# Altium schematic sheet [7]-INPUTS.SchDoc
size A4
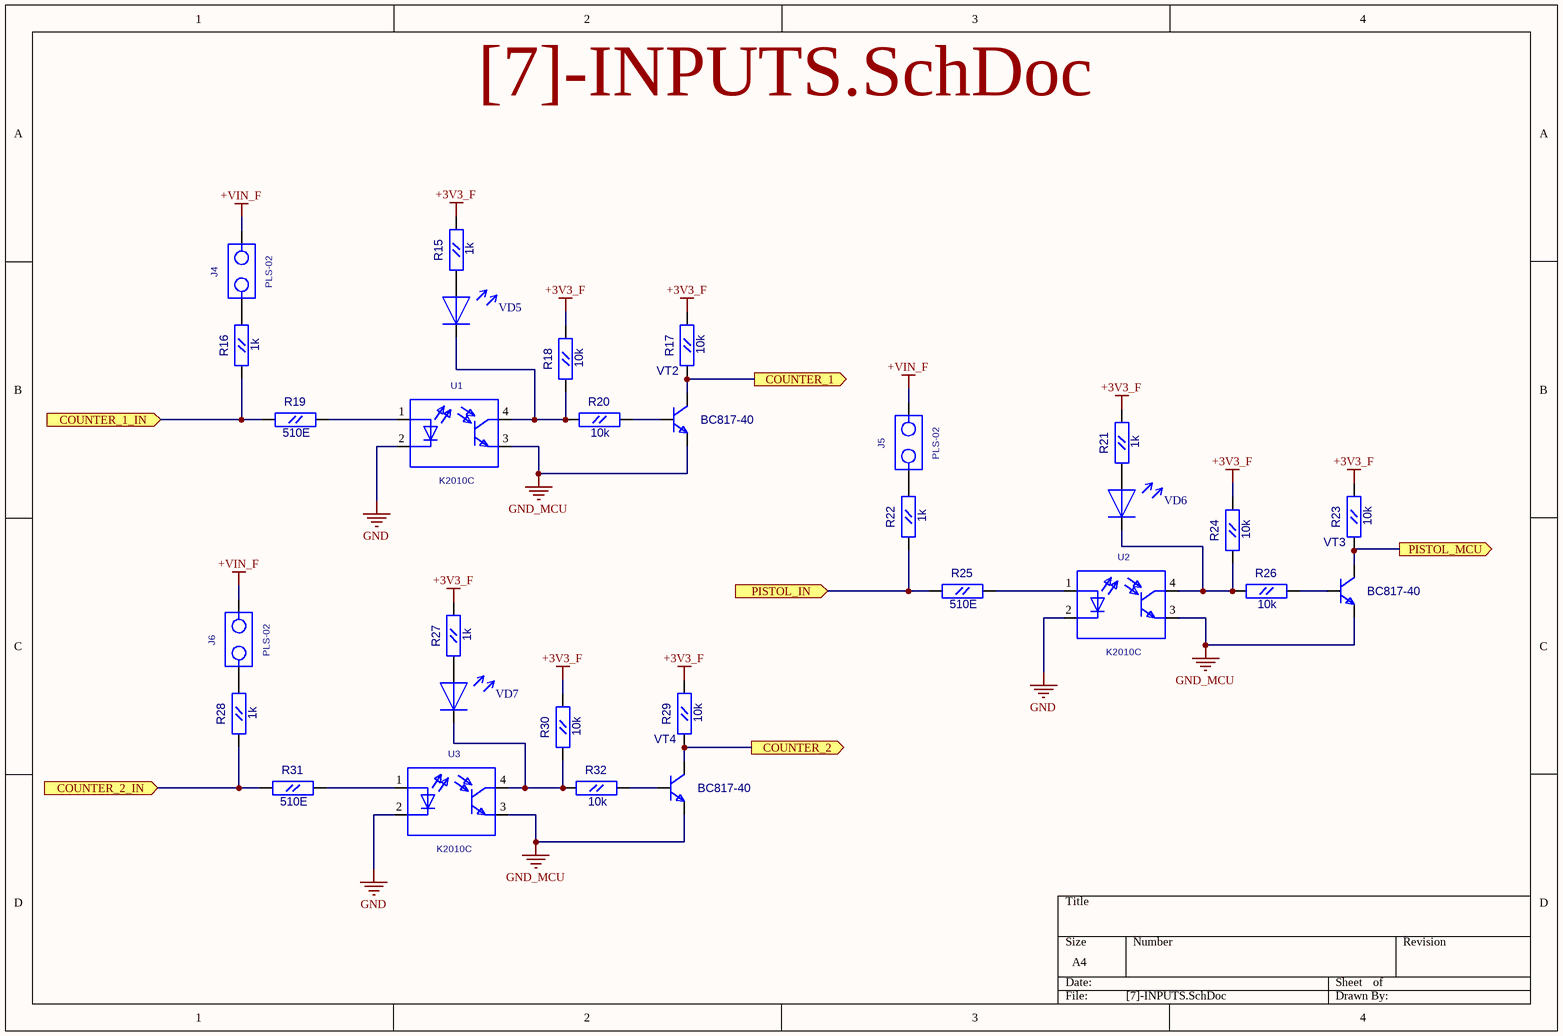
[diagram p0: [7]-INPUTS.SchDoc]

## Parts
J4  PLS-02  [PLS-02]
J5  PLS-02  [PLS-02]
J6  PLS-02  [PLS-02]
R15  1k  [RC0603]
R16  1k  [RC0603]
R17  10k  [RC0603]
R18  10k  [RC0603]
R19  510E  [RC0603]
R20  10k  [RC0603]
R21  1k  [RC0603]
R22  1k  [RC0603]
R23  10k  [RC0603]
R24  10k  [RC0603]
R25  510E  [RC0603]
R26  10k  [RC0603]
R27  1k  [RC0603]
R28  1k  [RC0603]
R29  10k  [RC0603]
R30  10k  [RC0603]
R31  510E  [RC0603]
R32  10k  [RC0603]
U1  K2010C  [PC817]
U2  K2010C  [PC817]
U3  K2010C  [PC817]
VD5  LED_0805  [LED0805]  (value not drawn)
VD6  LED_0805  [LED0805]  (value not drawn)
VD7  LED_0805  [LED0805]  (value not drawn)
VT2  BC817-40  [SOT-23(123)]
VT3  BC817-40  [SOT-23(123)]
VT4  BC817-40  [SOT-23(123)]

## Ports
COUNTER_1 (out), COUNTER_1_IN (in), COUNTER_2 (out), COUNTER_2_IN (in), PISTOL_IN (in), PISTOL_MCU (out)

## Nets
+3V3_F: R15.2(B) R17.2(B) R18.2(B) R21.2(B) R23.2(B) R24.2(B) R27.2(B) R29.2(B) R30.2(B)
+VIN_F: J4.2 J5.2 J6.2
GND: U1.2 U2.2 U3.2
GND_MCU: U1.3 U2.3 U3.3 VT2.2(E) VT3.2(E) VT4.2(E)
COUNTER_1: R17.1(A) VT2.3(C) ; port COUNTER_1
COUNTER_1_IN: R16.1(A) R19.1(A) ; port COUNTER_1_IN
COUNTER_2: R29.1(A) VT4.3(C) ; port COUNTER_2
COUNTER_2_IN: R28.1(A) R31.1(A) ; port COUNTER_2_IN
PISTOL_IN: R22.1(A) R25.1(A) ; port PISTOL_IN
PISTOL_MCU: R23.1(A) VT3.3(C) ; port PISTOL_MCU
NetJ4_1: J4.1 R16.2(B)
NetJ5_1: J5.1 R22.2(B)
NetJ6_1: J6.1 R28.2(B)
NetR15_1: R15.1(A) VD5.1
NetR18_1: R18.1(A) R20.1(A) U1.4 VD5.2
NetR19_2: R19.2(B) U1.1
NetR20_2: R20.2(B) VT2.1(B)
NetR21_1: R21.1(A) VD6.1
NetR24_1: R24.1(A) R26.1(A) U2.4 VD6.2
NetR25_2: R25.2(B) U2.1
NetR26_2: R26.2(B) VT3.1(B)
NetR27_1: R27.1(A) VD7.1
NetR30_1: R30.1(A) R32.1(A) U3.4 VD7.2
NetR31_2: R31.2(B) U3.1
NetR32_2: R32.2(B) VT4.1(B)

## Library data of the parts
R15-R32 = RC0603
  R15 R16 R21 R22 R27 R28: Value: 1k
  R17 R18 R20 R23 R24 R26 R29 R30 R32: Value: 10k
  R19 R25 R31: Value: 510E
U1-U3 = K10102C: Value: *
VT2-VT4 = BC846BLT1: NPN 500ma transistor; ComponentField7: Published 29-Sep-2000; OriginalName: BC846BLT1; Value: BC817-40
J4-J6 = PLS-02: Value: *
VD5-VD7 = LED_0805: Value: LED_0805